# EAGLE design AE-UM232R-V2 (EAGLE 5.10)
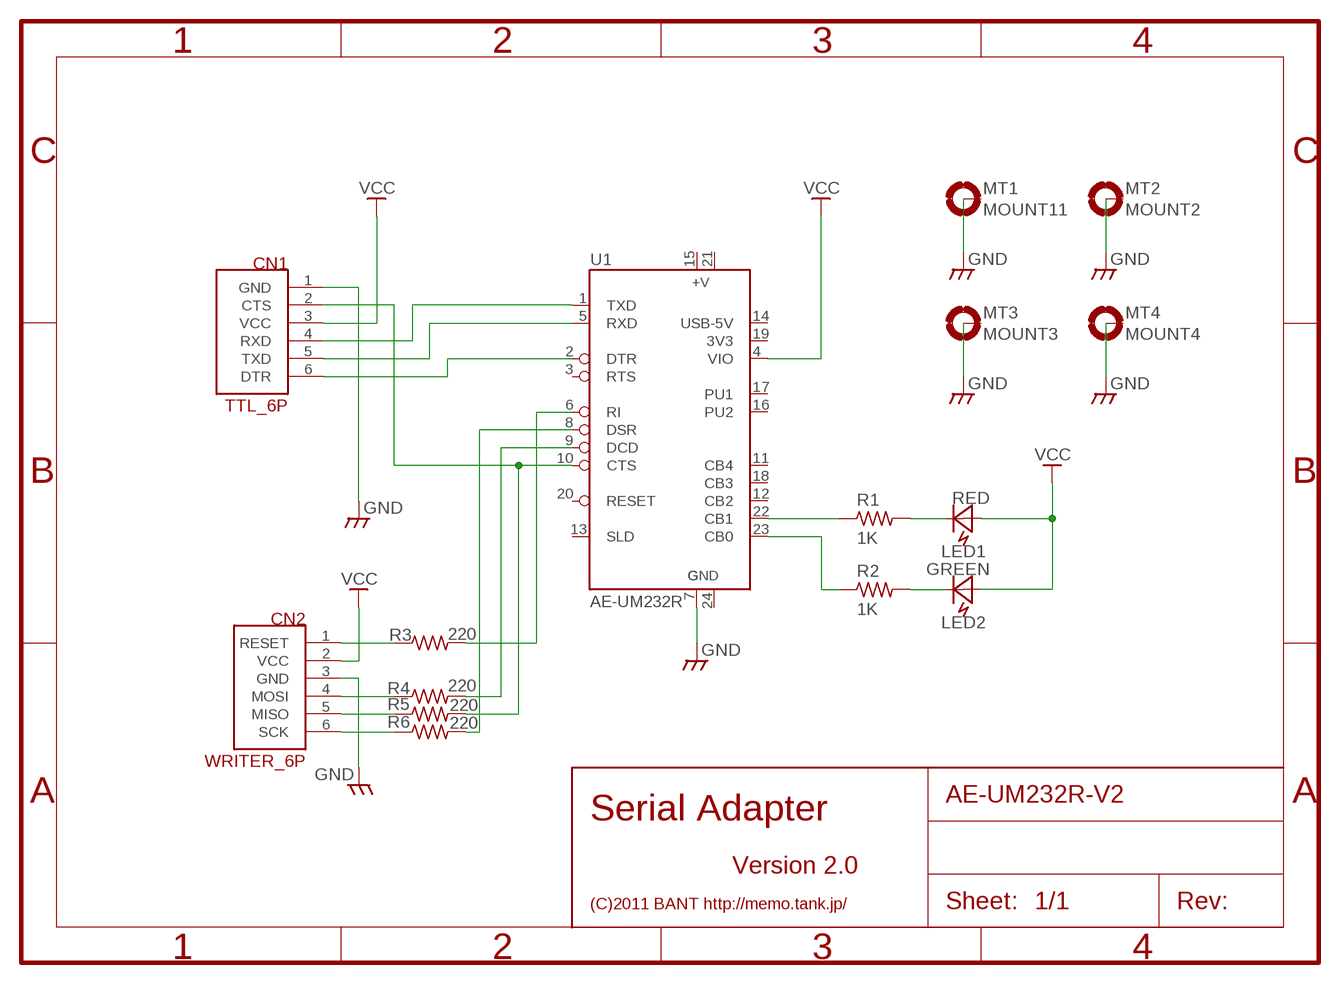
[diagram p0: schematic, sheet 1]

## Parts
CN1  TTL_6P  ARDUINO_TTL_6P  [CON_HRS_DIP_6]
CN2  WRITER_6P  HIDASPX_CON_6P  [CON_HRS_DIP_6]
LED1  RED  LED  [LED_3MM_VIRT_2]
LED2  GREEN  LED  [LED_3MM_VIRT_2]
MT1  MOUNT11  MOUNT-PAD2.1  [PAD-2.1]
MT2  MOUNT2  MOUNT-PAD2.1  [PAD-2.1]
MT3  MOUNT3  MOUNT-PAD2.1  [PAD-2.1]
MT4  MOUNT4  MOUNT-PAD2.1  [PAD-2.1]
R1  1K  R0.125W_4P  [R_0.125W_4]
R2  1K  R0.125W_4P  [R_0.125W_4]
R3  220  R0.125W_4P  [R_0.125W_4]
R4  220  R0.125W_4P  [R_0.125W_4]
R5  220  R0.125W_4P  [R_0.125W_4]
R6  220  R0.125W_4P  [R_0.125W_4]
U1  AE-UM232R  [DIL24-6]

## Nets
GND: CN1.1(GND) CN2.3(GND) MT1.B2,1(MOUNT) MT2.B2,1(MOUNT) MT3.B2,1(MOUNT) MT4.B2,1(MOUNT) U1.7(GND)
N$1: R1.1 U1.22(CB1)
N$2: R6.2 U1.8(DSR)
N$3: CN1.2(CTS) R5.2 U1.10(CTS)
N$4: CN1.6(DTR) U1.2(DTR)
N$5: CN2.1(RESET) R3.1
N$6: CN2.4(MOSI) R4.1
N$7: R3.2 U1.6(RI)
N$8: R4.2 U1.9(DCD)
N$9: CN2.5(MISO) R5.1
N$10: LED1.K R1.2
N$11: R2.1 U1.23(CB0)
N$12: LED2.K R2.2
N$13: CN1.5(TXD) U1.5(RXD)
N$14: CN1.4(RXD) U1.1(TXD)
N$15: CN2.6(SCK) R6.1
VDD: CN1.3(VCC) CN2.2(VCC) LED1.A LED2.A U1.4(VIO) ; supply symbol labelled VCC
Unconnected: U1.3(RTS) U1.11(CB4) U1.12(CB2) U1.13(SLD) U1.14(USB-5V) U1.15(VCC) U1.16(PU2) U1.17(PU1) U1.18(CB3) U1.19(3V3) U1.20(RESET) U1.21(VCC) U1.24(GND)

## Notes on the sheet
- Serial Adapter
- Version 2.0
- (C)2011 BANT http://memo.tank.jp/

## Library data of the parts
CN1 = bant2:ARDUINO_TTL_6P
CN2 = bant:HIDASPX_CON_6P
LED1 LED2 = MyLib:LED: 3mm LED
MT1-MT4 = MyLib:MOUNT-PAD: 2.1mm Mount Pad (Connectable to GND)
R1-R6 = MyLib:R: General Resiter 1/8W 1/4W 1/2W V/H
U1 = akizuki:AE-UM232R: Akizuki USB-Serial Converter (TTL-Level)

## Board
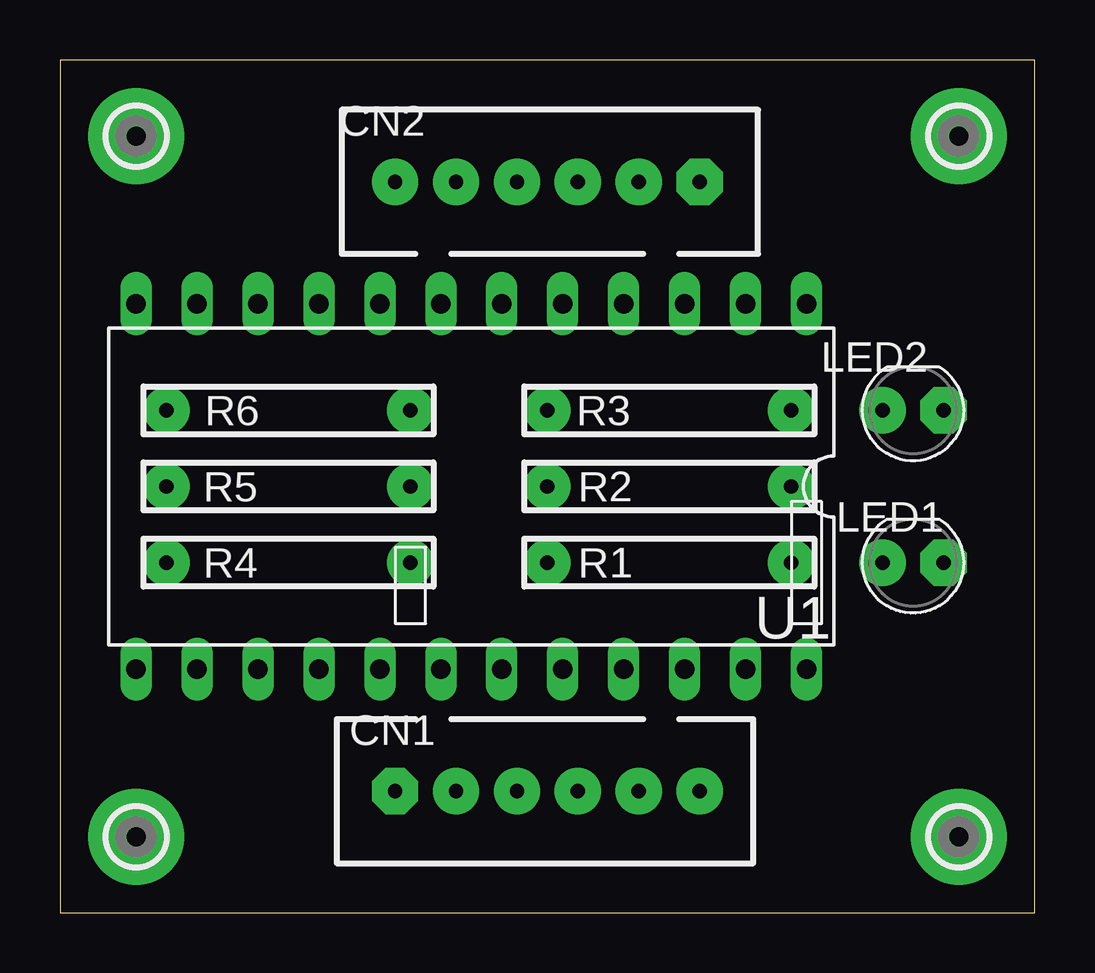
[diagram p1: board, top side]
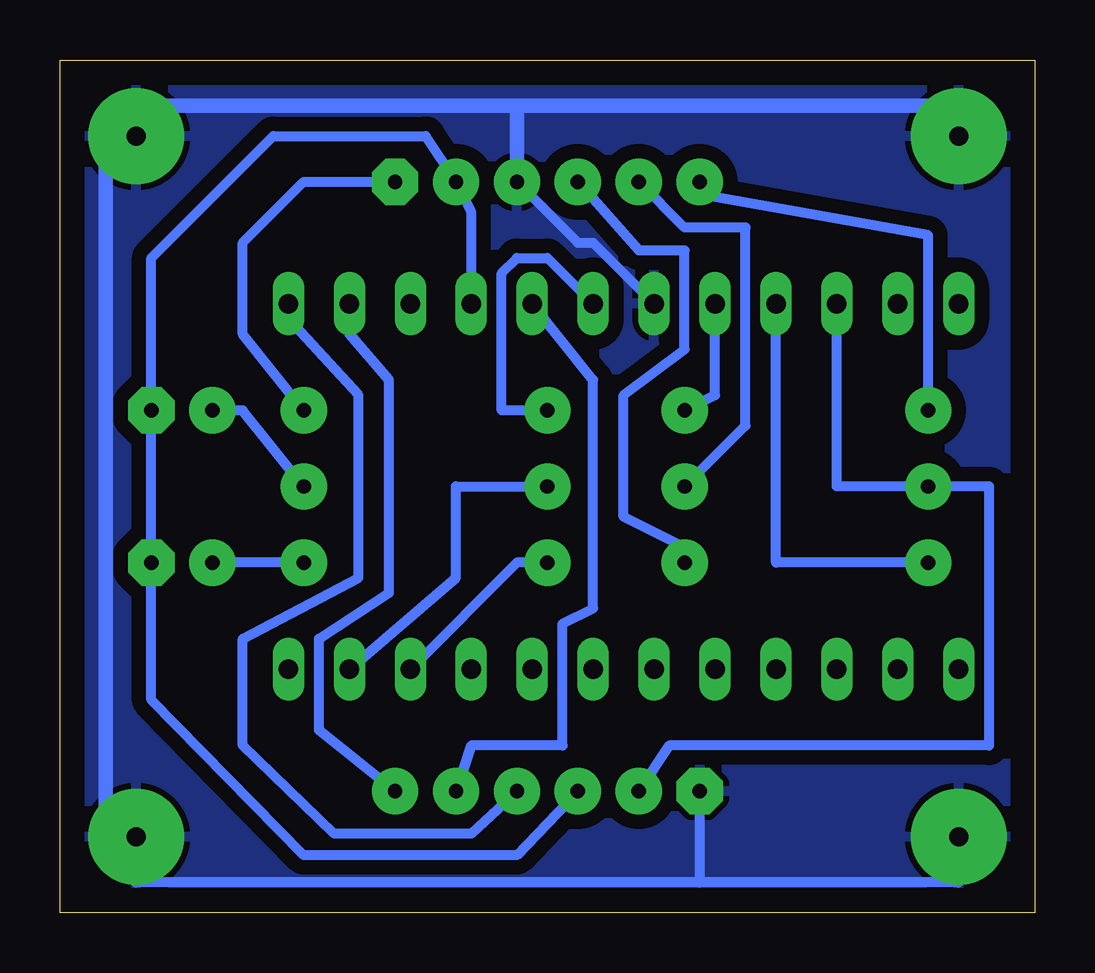
[diagram p2: board, bottom side, seen from below]

Size 40.64 x 35.56 mm. Coordinates in mm from the lower left corner, seen from the top.
Outline: 0,0 40.64,0 40.64,35.56 0,35.56 0,0
Copper layers (1*16): Top 0.035mm / dielectric 1.5mm / Bottom 0.035mm
Design rules "default": minimum track width 10mil, minimum drill 24mil, track to track 8mil, track to pad 8mil, pad to pad 8mil, via to via 8mil, smd to smd 8mil, copper to edge 40mil, drill to drill 8mil, minimum pad ring 10mil, minimum via ring 8mil, stop-mask expansion 4mil, vias tented up to drill 0mil, thermal gap 10mil

### Footprints (pad centres in the part's own frame; a part is rotated, then mirrored left to right if it is on the bottom)
CON_HRS_DIP_6 = drill 0.6 pad 1.93 octagon: 1 -6.35,0 | drill 0.6 pad 1.93 round: 2 -3.81,0; 3 -1.27,0; 4 1.27,0; 5 3.81,0; 6 6.35,0
LED_3MM_VIRT_2 = drill 0.6 pad 1.93 octagon: A -1.27,0 | drill 0.6 pad 1.93 round: K 1.27,0
PAD-2.1 = drill 0.8 pad 4 round: B2,1 0,0
R_0.125W_4 = drill 0.6 pad 1.93 round: 1 -5.08,0; 2 5.08,0
DIL24-6 = drill 0.813 long: 1 -13.97,-7.62; 2 -11.43,-7.62; 3 -8.89,-7.62; 4 -6.35,-7.62; 5 -3.81,-7.62; 6 -1.27,-7.62; 7 1.27,-7.62; 8 3.81,-7.62; 9 6.35,-7.62; 10 8.89,-7.62; 11 11.43,-7.62; 12 13.97,-7.62; 13 13.97,7.62; 14 11.43,7.62; 15 8.89,7.62; 16 6.35,7.62; 17 3.81,7.62; 18 1.27,7.62; 19 -1.27,7.62; 20 -3.81,7.62; 21 -6.35,7.62; 22 -8.89,7.62; 23 -11.43,7.62; 24 -13.97,7.62

### Placement (x,y rotation side)
CN1  20.32,5.08 0 top
CN2  20.32,30.48 180 top
LED1  35.56,14.61 180 top
LED2  35.56,20.95 180 top
MT1  3.17,3.17 0 top
MT2  37.47,3.17 0 top
MT3  37.47,32.38 0 top
MT4  3.17,32.38 0 top
R1  25.4,14.61 0 top
R2  25.4,17.78 0 top
R3  25.4,20.95 180 top
R4  9.53,14.61 180 top
R5  9.53,17.78 180 top
R6  9.53,20.95 0 top
U1  17.14,17.78 180 top

### Tracks (layer width: path | path; a pad name or v marks a point on that pad's centre or on a via)
GND
  Bottom 0.406: U1.7 18.41,27.94 19.05,27.94 CN2.3 | MT1.B2,1 3.17,1.27 13.97,1.27 | 13.97,1.27 37.47,1.27 MT2.B2,1 | 13.97,1.27 CN1.1
  Bottom 0.61: MT2.B2,1 38.73,3.17 38.73,32.38 MT3.B2,1 37.47,33.66 21.59,33.66 | 21.59,33.66 CN2.3 | MT4.B2,1 3.17,33.66 21.59,33.66
  pour Bottom (isolate 0.61): 0,35.56 0,0 40.64,0 40.64,35.56
N$1
  Bottom 0.406: U1.22 21.59,14.61 R1.1
N$2
  Bottom 0.406: U1.8 13.34,21.59 R6.2
N$3
  Bottom 0.406: U1.10 8.26,17.78 R5.2 1.91,17.78 1.91,6.99 15.24,6.99 CN1.2
N$4
  Bottom 0.406: U1.2 28.57,24.13 26.92,22.23 26.92,13.34 29.84,11.43 29.84,7.62 CN1.6
N$5
  Bottom 0.406: R3.1 33.02,24.13 33.02,27.94 30.48,30.48 CN2.1
N$6
  Bottom 0.406: R4.1 14.61,15.24 17.14,16.51 17.14,21.59 14.61,23.5 14.61,27.62 16.51,27.62 CN2.4
N$7
  Bottom 0.406: U1.6 20.32,27.3 21.59,27.3 22.23,26.67 22.23,20.95 R3.2
N$8
  Bottom 0.406: U1.9 10.79,14.61 R4.2
N$9
  Bottom 0.406: R5.1 12.06,20.32 12.06,28.57 14.61,28.57 CN2.5
N$10
  Bottom 0.406: R1.2 LED1.K
N$11
  Bottom 0.406: U1.23 24.13,13.97 24.13,17.78 R2.1
N$12
  Bottom 0.406: R2.2 33.02,20.95 LED2.K
N$13
  Bottom 0.406: U1.5 18.41,22.23 18.41,12.7 19.68,12.06 19.68,6.99 23.5,6.99 CN1.5
N$14
  Bottom 0.406: U1.1 31.11,24.77 28.19,21.59 28.19,13.97 33.02,11.43 33.02,6.99 29.21,3.3 23.5,3.3 CN1.4
N$15
  Bottom 0.406: R6.1 4.45,28.26 13.34,29.84 CN2.6
VDD
  Bottom 0.406: U1.4 23.5,29.21 CN2.2 25.4,32.38 31.75,32.38 36.83,27.3 LED2.A LED1.A 36.83,8.89 30.48,2.41 21.59,2.41 CN1.3